# Altium schematic sheet CMP.SchDoc
size A4; SheetNumber: 3; SheetTotal: 3
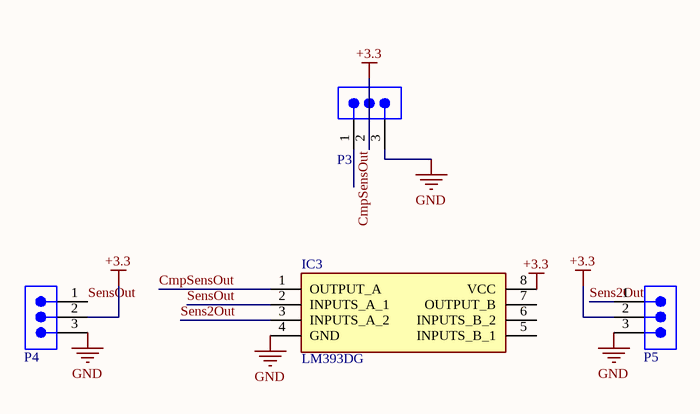
[diagram p0: CMP.SchDoc]

## Parts
IC3  LM393DG  [SOIC127P600X175-8N]
P3  61300311021  [61300311021]  (value not drawn)
P4  61300311021  [61300311021]  (value not drawn)
P5  61300311021  [61300311021]  (value not drawn)

## Nets
+3.3: IC3.8(VCC) P3.2 P4.2 P5.2
GND: IC3.4(GND) P3.3 P4.3 P5.3
CmpSensOut: IC3.1(OUTPUT_A) P3.1
Sens2Out: IC3.3(INPUTS_A_2) P5.1
SensOut: IC3.2(INPUTS_A_1) P4.1

Not connected (* = marked no-connect by the designer): IC3 5(INPUTS_B_1) 6(INPUTS_B_2) 7(OUTPUT_B)

## Library data of the parts
IC3 = LM393DG: Integrated Circuit; Manufacturer_Name: onsemi; Datasheet Link: https://www.onsemi.com/pub/Collateral/LM393-D.PDF; Height: 1.75mm; Manufacturer_Part_Number: LM393DG; Mouser Part Number: 863-LM393DG; Mouser Price/Stock: https://www.mouser.co.uk/ProductDetail/onsemi/LM393DG?qs=2OtswVQKCOHzXsheSqC0ow%3D%3D; Arrow Part Number: LM393DG; Arrow Price/Stock: https://www.arrow.com/en/products/lm393dg/on-semiconductor?region=nac
P3-P5 = 61300311021: WR-PHD Pin Header, THT, Angled, pitch 2.54mm, 1 Row, 3P; Manufacturer: Wurth Elektronik; Contact Resistance: 20mΩ; Rated Current: 3A; Working Voltage: 250V; Withstanding Voltage: 500V; ComponentLink1Description: Website Link; ComponentLink1URL: https://www.we-online.com/redexpert/article/61300311021?ad; ComponentLink2Description: Datasheet Link; ComponentLink2URL: https://www.we-online.com/redexpert/spec/61300311021?ad; Manufacturer Part Number: 61300311021; Category: Board-to-Board Connectors; Match Code: WR-PHD; Mount: Through Hole; Operating Temperature Max: 105°C; Operating Temperature Min: -40°C; Packaging: Bag; Gender: Pin Header; Number of Pins: 3; Number of Rows: 1; Orientation: Angled; Pitch: 2.54mm; Supplier 1: Digi-Key; Supplier Part Number 1: 732-5336-ND